# Altium schematic sheet Breakout_Connector.SchDoc
size A4; PageSetup: Record=PageOptions|CenterHorizontal=True|CenterVertical=True|PrintScale=0.92|XCorrection=1.00|YCorrection=1.00|PrintKind=0|BorderSize=5000000|LeftOffset=0|BottomOffset=0|Orientation=2|PaperLength=1000|PaperWidth=1000|Scale=100|PaperSource=7|PrintQuality=-4|MediaType=1|DitherType=10|PrintScaleMode=1|PaperKind=A4; CompanyName: Technische Hochschule Nürnberg Georg Simon Ohm; Organization: UltraZohm; Address1: Kesslerplatz 12; Address2: 90489 Nürnberg; Address3: GERMANY; DocumentNumber: 3; SheetNumber: 3; SheetTotal: 5; Website: www.ultrazohm.com
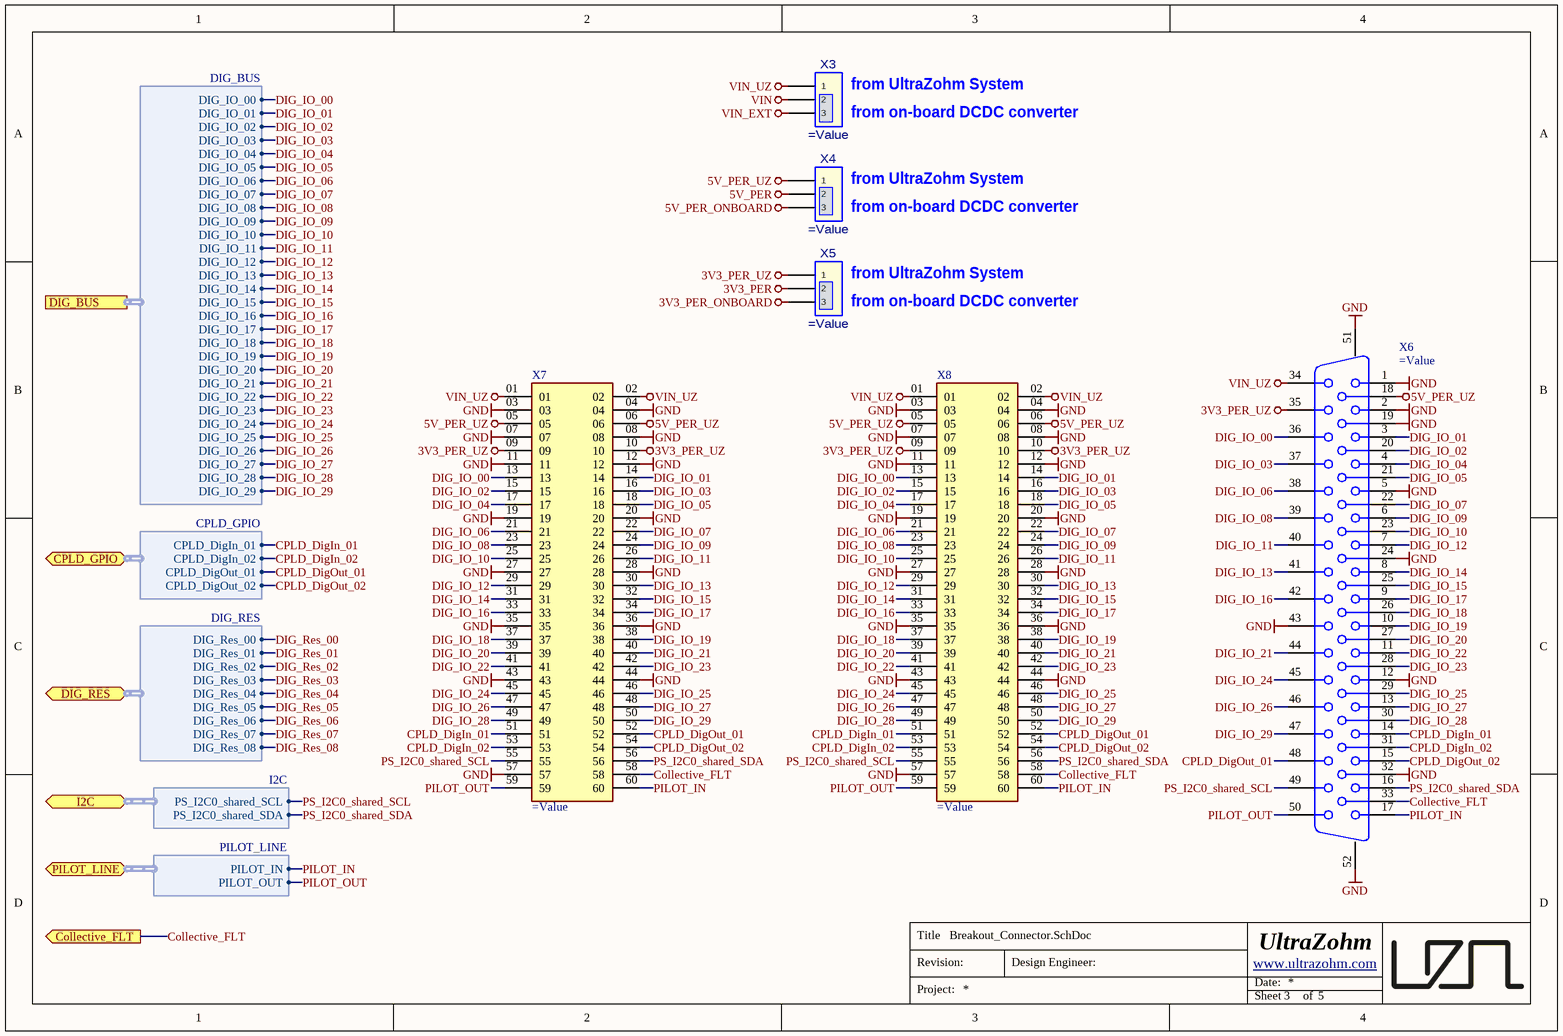
[diagram p0: Breakout_Connector.SchDoc]

## Parts
X3  (no value)  [TSW-103-XX-XXX-S]
X4  (no value)  [TSW-103-XX-XXX-S]
X5  (no value)  [TSW-103-XX-XXX-S]
X6  (no value)  [dsub50_male_163A18339X]
X7  (no value)  [TSM-130-01-F-DV]
X8  (no value)  [HTSS-130-01-L-DV]

## Ports
Collective_FLT (out), CPLD_GPIO (bidir, harness CPLD_GPIO), DIG_BUS (harness DIG_BUS), DIG_RES (bidir, harness DIG_RES), I2C (bidir, harness I2C), PILOT_LINE (bidir, harness PILOT_LINE)

## Harnesses
DIG_BUS: DIG_IO_01, DIG_IO_02, DIG_IO_03, DIG_IO_04, DIG_IO_05, DIG_IO_06, DIG_IO_07, DIG_IO_08, DIG_IO_09, DIG_IO_10, DIG_IO_11, DIG_IO_12, DIG_IO_13, DIG_IO_14, DIG_IO_15, DIG_IO_16, DIG_IO_17, DIG_IO_18, DIG_IO_19, DIG_IO_20, DIG_IO_21, DIG_IO_22, DIG_IO_23, DIG_IO_24, DIG_IO_25, DIG_IO_26, DIG_IO_27, DIG_IO_28, DIG_IO_29, DIG_IO_00
CPLD_GPIO: CPLD_DigIn_01, CPLD_DigOut_01, CPLD_DigIn_02, CPLD_DigOut_02
DIG_RES: DIG_Res_00, DIG_Res_08, DIG_Res_01, DIG_Res_02, DIG_Res_03, DIG_Res_04, DIG_Res_05, DIG_Res_06, DIG_Res_07
I2C: PS_I2C0_shared_SDA, PS_I2C0_shared_SCL
PILOT_LINE: PILOT_OUT, PILOT_IN

## Nets
3V3_PER: X5.2
3V3_PER_ONBOARD: X5.3
3V3_PER_UZ: X5.1 X6.35 X7.09 X7.10 X8.09 X8.10
5V_PER: X4.2
5V_PER_ONBOARD: X4.3
5V_PER_UZ: X4.1 X6.18 X7.05 X7.06 X8.05 X8.06
GND: X6.1 X6.2 X6.5 X6.12 X6.19 X6.24 X6.32 X6.43 X6.51 X6.52 X7.03 X7.04 X7.07 X7.08 X7.11 X7.12 X7.19 X7.20 X7.27 X7.28 X7.35 X7.36 X7.43 X7.44 X7.57 X8.03 X8.04 X8.07 X8.08 X8.11 X8.12 X8.19 X8.20 X8.27 X8.28 X8.35 X8.36 X8.43 X8.44 X8.57
VIN: X3.2
VIN_EXT: X3.3
VIN_UZ: X3.1 X6.34 X7.01 X7.02 X8.01 X8.02
Collective_FLT: X6.33 X7.58 X8.58 ; port Collective_FLT
CPLD_DigIn_01: X6.14 X7.51 X8.51 ; port CPLD_GPIO.CPLD_DigIn_01
CPLD_DigIn_02: X6.31 X7.53 X8.53 ; port CPLD_GPIO.CPLD_DigIn_02
CPLD_DigOut_01: X6.48 X7.52 X8.52 ; port CPLD_GPIO.CPLD_DigOut_01
CPLD_DigOut_02: X6.15 X7.54 X8.54 ; port CPLD_GPIO.CPLD_DigOut_02
DIG_IO_00: X6.36 X7.13 X8.13 ; port DIG_BUS.DIG_IO_00
DIG_IO_01: X6.3 X7.14 X8.14 ; port DIG_BUS.DIG_IO_01
DIG_IO_02: X6.20 X7.15 X8.15 ; port DIG_BUS.DIG_IO_02
DIG_IO_03: X6.37 X7.16 X8.16 ; port DIG_BUS.DIG_IO_03
DIG_IO_04: X6.4 X7.17 X8.17 ; port DIG_BUS.DIG_IO_04
DIG_IO_05: X6.21 X7.18 X8.18 ; port DIG_BUS.DIG_IO_05
DIG_IO_06: X6.38 X7.21 X8.21 ; port DIG_BUS.DIG_IO_06
DIG_IO_07: X6.22 X7.22 X8.22 ; port DIG_BUS.DIG_IO_07
DIG_IO_08: X6.39 X7.23 X8.23 ; port DIG_BUS.DIG_IO_08
DIG_IO_09: X6.6 X7.24 X8.24 ; port DIG_BUS.DIG_IO_09
DIG_IO_10: X6.23 X7.25 X8.25 ; port DIG_BUS.DIG_IO_10
DIG_IO_11: X6.40 X7.26 X8.26 ; port DIG_BUS.DIG_IO_11
DIG_IO_12: X6.7 X7.29 X8.29 ; port DIG_BUS.DIG_IO_12
DIG_IO_13: X6.41 X7.30 X8.30 ; port DIG_BUS.DIG_IO_13
DIG_IO_14: X6.8 X7.31 X8.31 ; port DIG_BUS.DIG_IO_14
DIG_IO_15: X6.25 X7.32 X8.32 ; port DIG_BUS.DIG_IO_15
DIG_IO_16: X6.42 X7.33 X8.33 ; port DIG_BUS.DIG_IO_16
DIG_IO_17: X6.9 X7.34 X8.34 ; port DIG_BUS.DIG_IO_17
DIG_IO_18: X6.26 X7.37 X8.37 ; port DIG_BUS.DIG_IO_18
DIG_IO_19: X6.10 X7.38 X8.38 ; port DIG_BUS.DIG_IO_19
DIG_IO_20: X6.27 X7.39 X8.39 ; port DIG_BUS.DIG_IO_20
DIG_IO_21: X6.44 X7.40 X8.40 ; port DIG_BUS.DIG_IO_21
DIG_IO_22: X6.11 X7.41 X8.41 ; port DIG_BUS.DIG_IO_22
DIG_IO_23: X6.28 X7.42 X8.42 ; port DIG_BUS.DIG_IO_23
DIG_IO_24: X6.45 X7.45 X8.45 ; port DIG_BUS.DIG_IO_24
DIG_IO_25: X6.29 X7.46 X8.46 ; port DIG_BUS.DIG_IO_25
DIG_IO_26: X6.46 X7.47 X8.47 ; port DIG_BUS.DIG_IO_26
DIG_IO_27: X6.13 X7.48 X8.48 ; port DIG_BUS.DIG_IO_27
DIG_IO_28: X6.30 X7.49 X8.49 ; port DIG_BUS.DIG_IO_28
DIG_IO_29: X6.47 X7.50 X8.50 ; port DIG_BUS.DIG_IO_29
DIG_Res_00: port DIG_RES.DIG_Res_00
DIG_Res_01: port DIG_RES.DIG_Res_01
DIG_Res_02: port DIG_RES.DIG_Res_02
DIG_Res_03: port DIG_RES.DIG_Res_03
DIG_Res_04: port DIG_RES.DIG_Res_04
DIG_Res_05: port DIG_RES.DIG_Res_05
DIG_Res_06: port DIG_RES.DIG_Res_06
DIG_Res_07: port DIG_RES.DIG_Res_07
DIG_Res_08: port DIG_RES.DIG_Res_08
PILOT_IN: X6.17 X7.60 X8.60 ; port PILOT_LINE.PILOT_IN
PILOT_OUT: X6.50 X7.59 X8.59 ; port PILOT_LINE.PILOT_OUT
PS_I2C0_shared_SCL: X6.49 X7.55 X8.55 ; port I2C.PS_I2C0_shared_SCL
PS_I2C0_shared_SDA: X6.16 X7.56 X8.56 ; port I2C.PS_I2C0_shared_SDA

## Notes on the sheet
- (near X3) from UltraZohm System
- (near X3) from on-board DCDC converter
- (near X4) from UltraZohm System
- (near X4) from on-board DCDC converter
- (near X5) from UltraZohm System
- (near X5) from on-board DCDC converter
- Title
- Revision:
- Design Engineer:
- Date:
- Project:
- Sheet
- of

## Library data of the parts
X3-X5 = TSW-103-XX-XXX-S: .025[0.64] SQ. POST TERMINAL STRIP ASSEMBLY.; Manufacturer: SAMTEC; MPN: TSW-103-07-F-S; Value: TSW-103-07-F-S; Created: 2020_11_26_AGeiger
X6 = DSUB50_male: D-SUB, male, right angle, 50pos, 9.4mm pitch; MPN: 163A18339X; MF: CONEC; Value: 163A18339X; Supplier Part Number 1: D-SUB ST 50GWC; Supplier 1: Reichelt; Supplier 2: Mouser; Supplier 3: Digi-Key; Created: 2021_03_25_AGeiger
X7 = TSM-130-01-F-DV: MF: Samtec; MPN: TSM-130-01-F-DV; Value: TSM-130-01-F-DV; Created: 2021_03_23_AGeiger
X8 = HTSS-130-01-L-DV: MF: SAMTEC; Value: HTSS-130-01-L-DV; MPN: HTSS-130-01-L-DV